# EAGLE design Weather_Station (EAGLE 9.6.2)
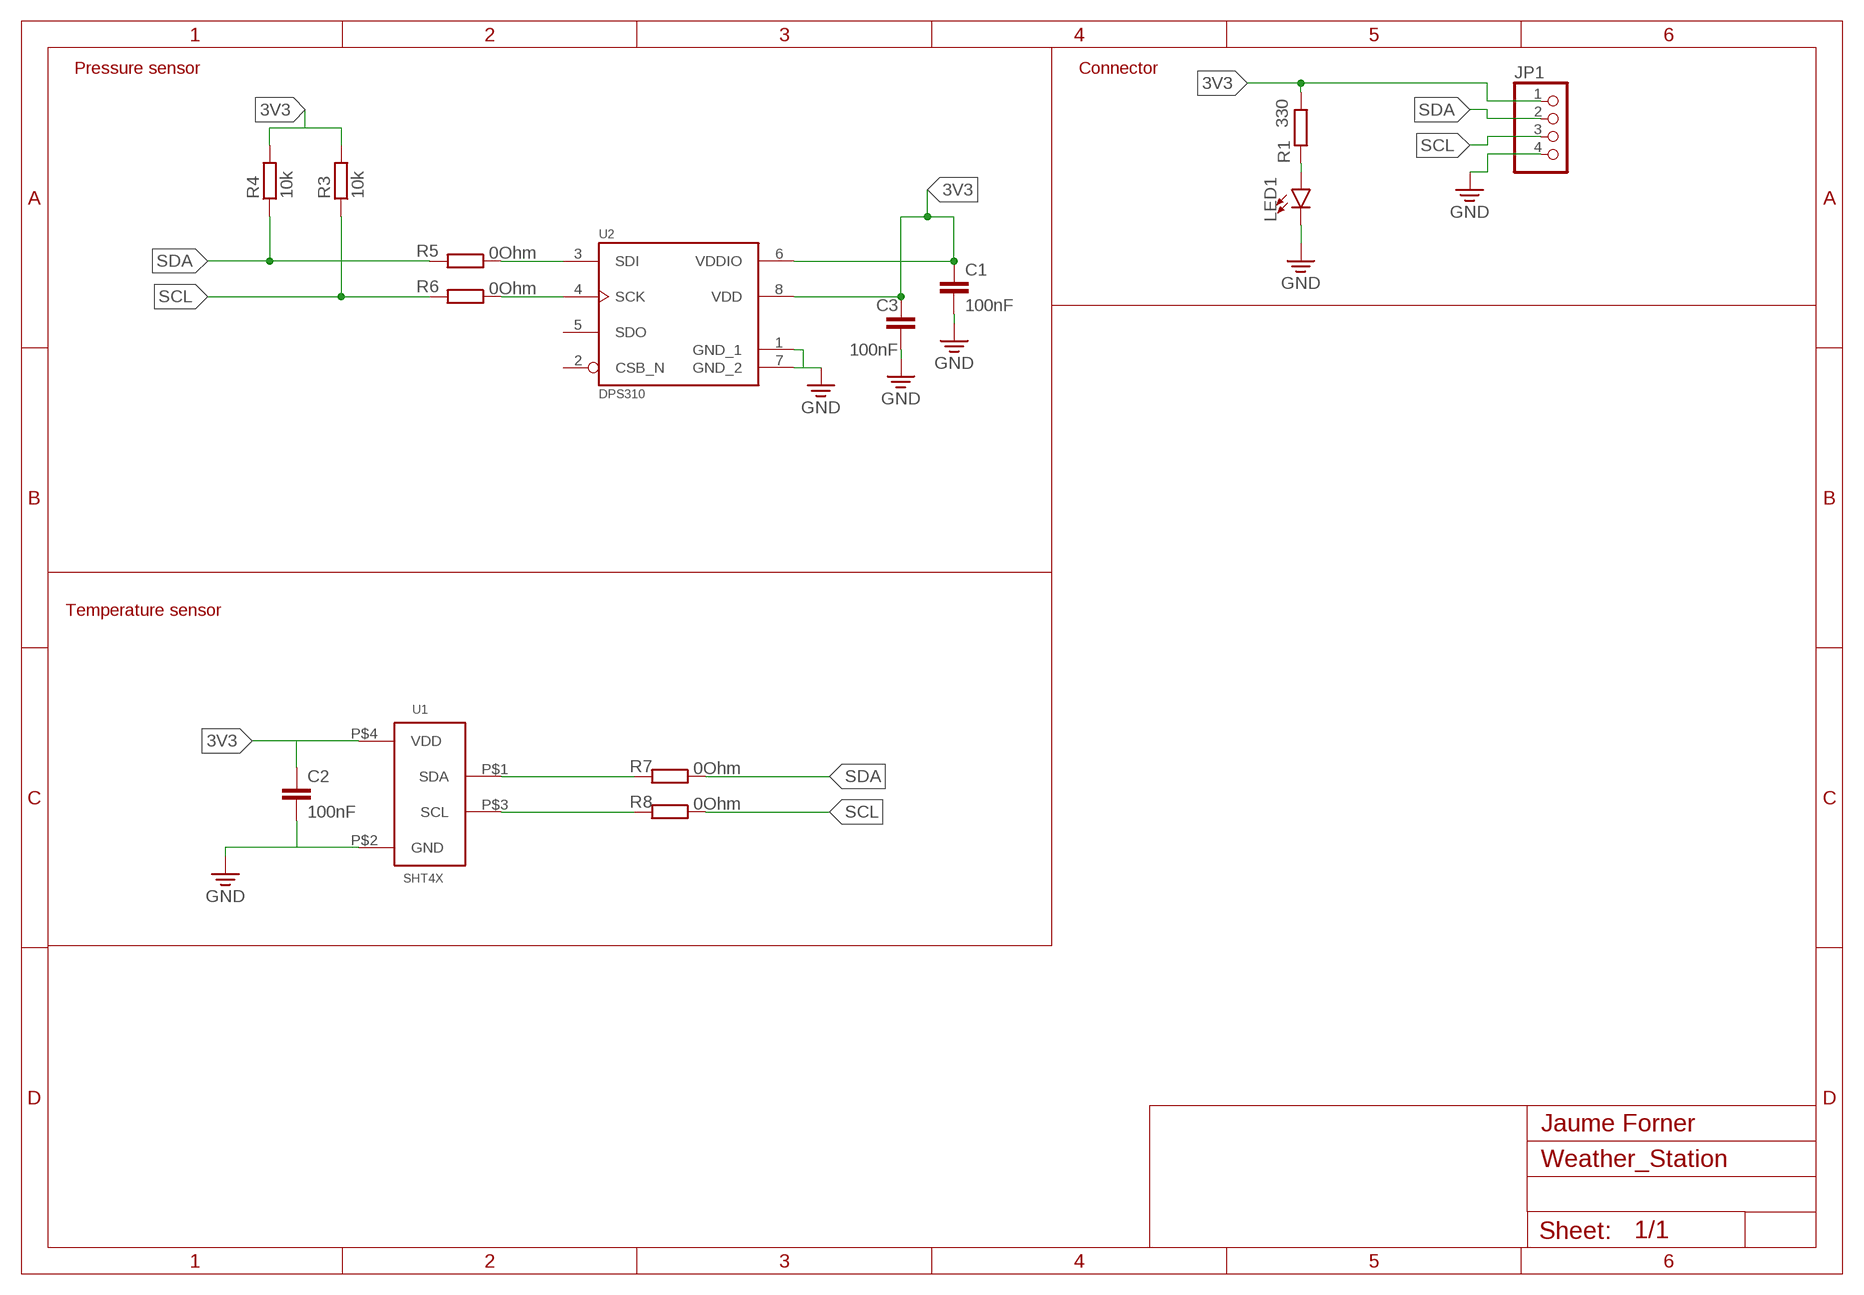
[diagram p0: schematic, sheet 1]

## Parts
C1  100nF  C-EUC0603K  [C0603K]
C2  100nF  C-EUC0603K  [C0603K]
C3  100nF  C-EUC0603K  [C0603K]
JP1  PINHD-1X4  [1X04]
LED1  LED0603  [LED-0603]
R1  330  R-EU_R0603  [R0603]
R3  10k  R-EU_R0603  [R0603]
R4  10k  R-EU_R0603  [R0603]
R5  0Ohm  R-EU_R0603  [R0603]
R6  0Ohm  R-EU_R0603  [R0603]
R7  0Ohm  R-EU_R0603  [R0603]
R8  0Ohm  R-EU_R0603  [R0603]
U1  SHT4X  [SHT40-SHT41]
U2  DPS310  [LGA8S145X65P2X4_200X250X110-V]

## Nets
3V3: C1.1 C2.1 C3.1 JP1.1 R1.1 R3.2 R4.2 U1.P$4(VDD) U2.6(VDDIO) U2.8(VDD)
GND: C1.2 C2.2 C3.2 JP1.4 LED1.C U1.P$2(GND) U2.1(GND_1) U2.7(GND_2)
N$1: R6.1 U2.4(SCK)
N$2: R5.1 U2.3(SDI)
N$3: R7.2 U1.P$1(SDA)
N$4: R8.2 U1.P$3(SCL)
N$15: LED1.A R1.2
SCL: JP1.3 R3.1 R6.2 R8.1
SDA: JP1.2 R4.1 R5.2 R7.1
Unconnected: U2.2(CSB_N) U2.5(SDO)

## Notes on the sheet
- Pressure sensor | Connector
- Temperature sensor
- Jaume Forner

## Library data of the parts
C1-C3 = rcl:C-EU: CAPACITOR, European symbol; SPICEPREFIX: C
JP1 = pinhead:PINHD-1X4: PIN HEADER
LED1 = SparkFun-LED:LED: LED (Generic) Standard schematic elements and footprints for 5mm, 3mm, 1206, and 0603 sized LEDs. Generic LEDs with no color specified.
R1 R3-R8 = rcl:R-EU_: RESISTOR, European symbol; SPICEPREFIX: R
U1 = Home_Automation:SHT4X: Temperature and relative humidity sensor STH4x
U2 = DPS310:DPS310: DPS310 LGA8S145X65P2X4_200X250X110-V Digital Barometric Pressure Sensor for Portable Devices

## Board
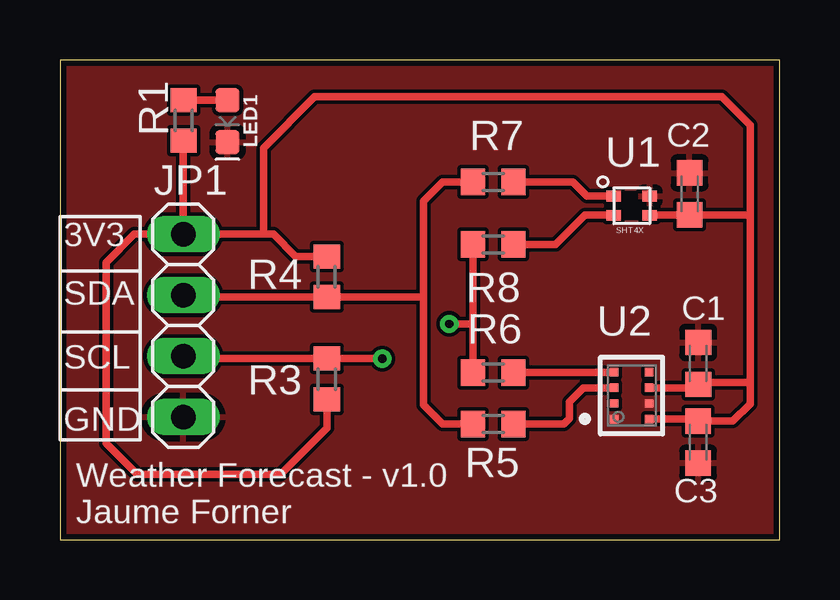
[diagram p1: board, top side]
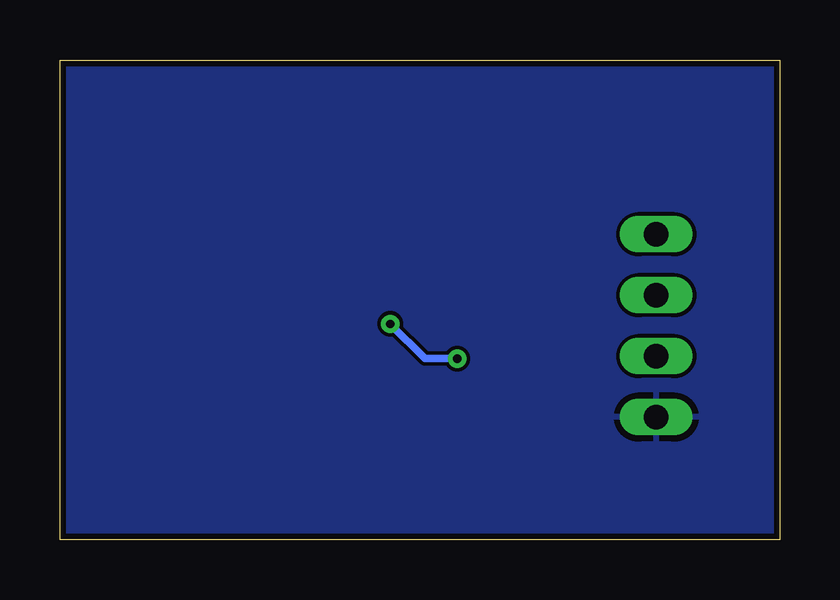
[diagram p2: board, bottom side, seen from below]

Size 30 x 20 mm. Coordinates in mm from the lower left corner, seen from the top.
Outline: 0,0 30,0 30,20 0,20 0,0
Copper layers (1*16): Top 0.035mm / dielectric 1.5mm / Bottom 0.035mm
Design rules "default *": minimum track width 6mil, minimum drill 0.35mm, track to track 6mil, track to pad 6mil, pad to pad 6mil, via to via 6mil, smd to smd 6mil, copper to edge 10mil, drill to drill 6mil, minimum pad ring 10mil, minimum via ring 8mil, stop-mask expansion 4mil, vias tented up to drill 0mil, thermal gap 10mil

### Footprints (pad centres in the part's own frame; a part is rotated, then mirrored left to right if it is on the bottom)
C0603K = smd 1.05 x 1.08: 1 -0.875,0; 2 0.875,0
1X04 = drill 1.016 long: 1 -3.81,0; 2 -1.27,0; 3 1.27,0; 4 3.81,0
LED-0603 = smd 1 x 1: A -0.877,0; C 0.877,0
R0603 = smd 1 x 1.1: 1 -0.85,0; 2 0.85,0
SHT40-SHT41 = smd 0.6 x 0.45: P$1 -0.75,0.4; P$2 0.75,0.4; P$3 -0.75,-0.4; P$4 0.75,-0.4
LGA8S145X65P2X4_200X250X110-V = smd 0.35 x 0.35: 1 -0.975,0.725; 2 -0.325,0.725; 3 0.325,0.725; 4 0.975,0.725; 5 0.975,-0.725; 6 0.325,-0.725; 7 -0.325,-0.725; 8 -0.975,-0.725

### Placement (x,y rotation side)
C1  26.61,7.35 90 top
C2  26.25,14.41 90 top
C3  26.6,4.06 270 top
JP1  5.14,8.92 270 top
LED1  6.99,17.45 270 top
R1  5.16,17.48 90 top
R3  11.13,6.69 270 top
R4  11.12,10.96 90 top
R5  18.06,4.82 180 top
R6  18.06,6.96 180 top
R7  18.06,14.91 0 top
R8  18.06,12.31 0 top
U1  23.83,13.92 0 top
U2  23.83,6 90 top

### Tracks (layer width: path | path; a pad name or v marks a point on that pad's centre or on a via)
3V3
  Top 0.305: JP1.1 5.14,16.62 R1.1 | U1.P$4 26.23,13.52 C2.1 28.78,13.54 | U2.8 26.52,5.03 C3.1 28.05,4.94 28.78,5.66 28.78,6.55 | U2.6 26.46,6.33 C1.1 26.69,6.55 28.78,6.55 | JP1.1 8.48,12.73 | 8.48,12.73 8.91,12.73 9.83,11.81 R4.2 | 8.48,12.73 8.48,16.33 10.62,18.47 27.58,18.47 28.78,17.27 28.78,13.54 | 28.78,13.54 28.78,6.55 | JP1.1 3.1,12.73 1.93,11.56 1.93,4.01 3.23,2.72 9.2,2.72 11.13,4.65 R3.2
GND
  pour Top: 0,0 0,19.97 29.99,19.97 29.99,0
  pour Bottom: 0,20 0,0 30,0 30,20
N$1
  Top 0.305: R6.1 23.1,6.96 U2.4
N$2
  Top 0.305: U2.3 21.82,6.33 21.23,5.74 21.23,5.05 21,4.82 R5.1
N$3
  Top 0.305: U1.P$1 21.97,14.32 21.39,14.91 19.02,14.91 R7.2
N$4
  Top 0.305: R8.2 20.66,12.31 21.89,13.54 23.07,13.54 U1.P$3
N$15
  Top 0.305: R1.2 LED1.A
SCL  (via drill 0.35)
  Top 0.305: R8.1 17.21,8.99 | 17.21,8.99 R6.2 | JP1.3 5.24,7.55 10.9,7.55 | 10.9,7.55 R3.1 | 17.21,8.99 v16.23,8.99 | v13.44,7.54 10.9,7.54 10.9,7.55
  Bottom 0.305: v16.23,8.99 14.78,7.54 v13.44,7.54
SDA
  Top 0.305: R7.1 15.95,14.91 15.16,14.12 15.16,10.11 | R5.2 15.96,4.82 15.16,5.61 15.16,10.11 | 15.16,10.11 R4.1 5.22,10.11 JP1.2 | 15.16,10.11

### Text on the board
tPlace: 3V3 | SDA | SCL | GND | Weather Forecast - v1.0 / Jaume Forner